# Altium schematic sheet Clock.SchDoc
size A3
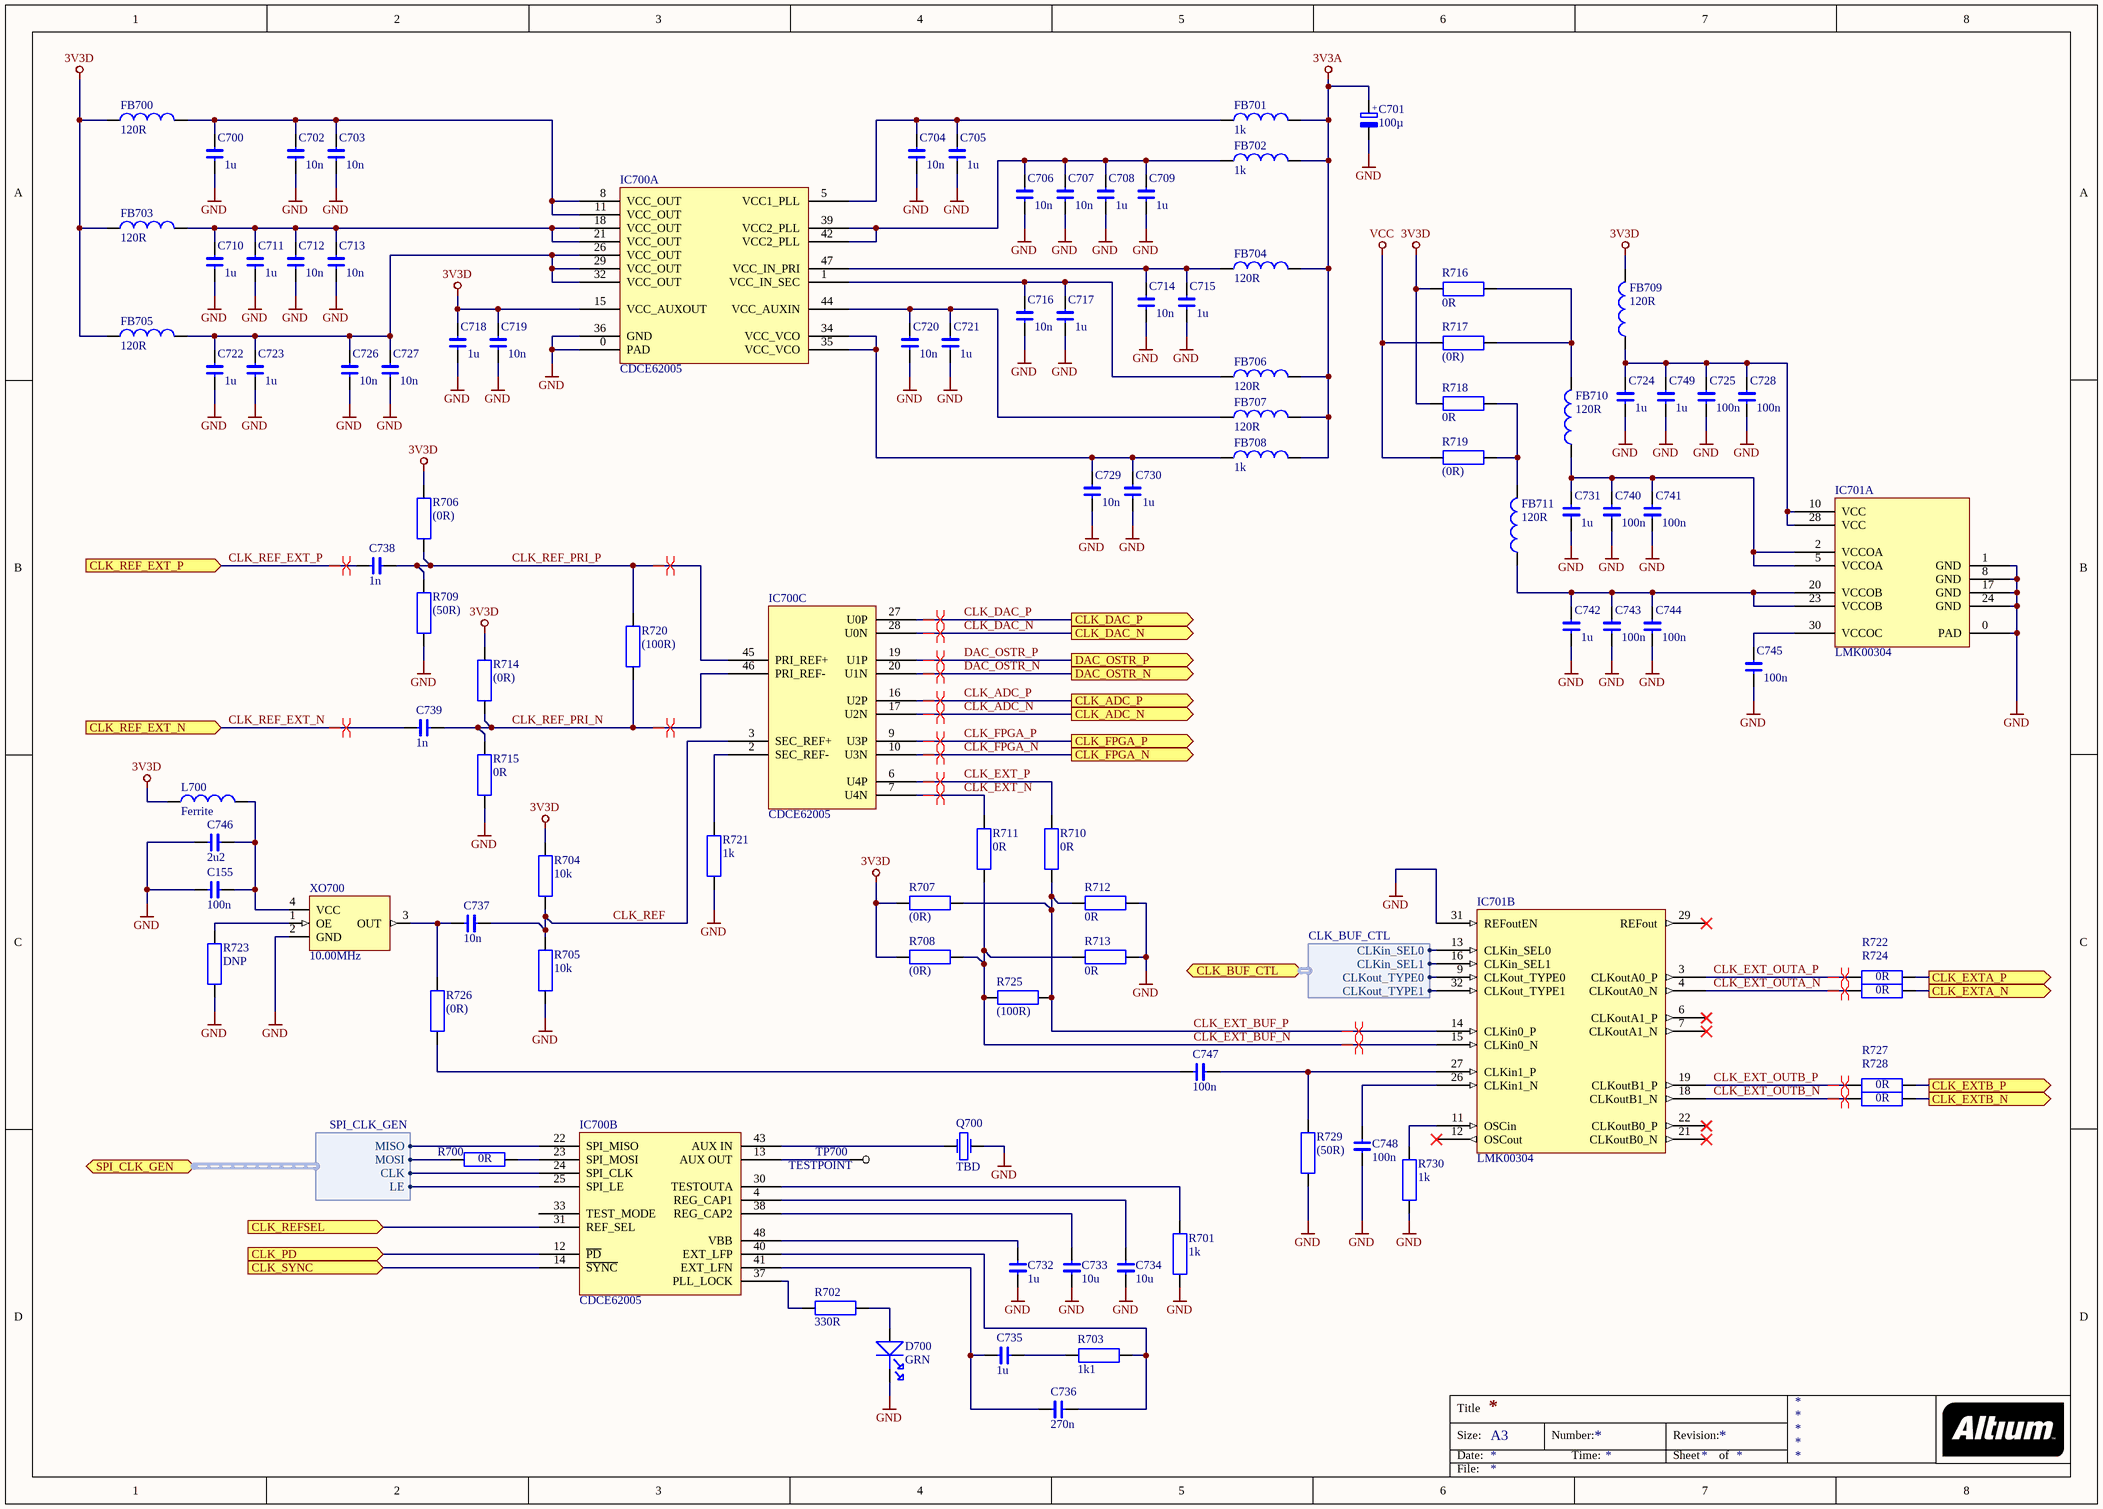
[diagram p0: Clock.SchDoc]

## Parts
C155  100n  [0603 SMALL OUTLINE]
C700  1u  [0603 SMALL OUTLINE]
C701  100µ  [SMD_ELKO_6.3]
C702  10n  [0402]
C703  10n  [0402]
C704  10n  [0402]
C705  1u  [0603 SMALL OUTLINE]
C706  10n  [0402]
C707  10n  [0402]
C708  1u  [0603 SMALL OUTLINE]
C709  1u  [0603 SMALL OUTLINE]
C710  1u  [0603 SMALL OUTLINE]
C711  1u  [0603 SMALL OUTLINE]
C712  10n  [0402]
C713  10n  [0402]
C714  10n  [0402]
C715  1u  [0603 SMALL OUTLINE]
C716  10n  [0402]
C717  1u  [0603 SMALL OUTLINE]
C718  1u  [0603 SMALL OUTLINE]
C719  10n  [0402]
C720  10n  [0402]
C721  1u  [0603 SMALL OUTLINE]
C722  1u  [0603 SMALL OUTLINE]
C723  1u  [0603 SMALL OUTLINE]
C724  1u  [0603 SMALL OUTLINE]
C725  100n  [0402]
C726  10n  [0402]
C727  10n  [0402]
C728  100n  [0402]
C729  10n  [0402]
C730  1u  [0603 SMALL OUTLINE]
C731  1u  [0603 SMALL OUTLINE]
C732  1u  [0603 SMALL OUTLINE]
C733  10u  [0805 SMALL OUTLINE]
C734  10u  [0805 SMALL OUTLINE]
C735  1u  [0603 SMALL OUTLINE]
C736  270n  [0603 SMALL OUTLINE]
C737  10n  [0603 SMALL OUTLINE]
C738  1n  [0603 SMALL OUTLINE]
C739  1n  [0603 SMALL OUTLINE]
C740  100n  [0402]
C741  100n  [0402]
C742  1u  [0603 SMALL OUTLINE]
C743  100n  [0402]
C744  100n  [0402]
C745  100n  [0402]
C746  2u2  [0603 SMALL OUTLINE]
C747  100n  [0603 SMALL OUTLINE]
C748  100n  [0402]
C749  1u  [0603 SMALL OUTLINE]
D700  GRN  [LED SMD 0603]
FB700  120R  [0805 SMALL OUTLINE]
FB701  1k  [0805 SMALL OUTLINE]
FB702  1k  [0805 SMALL OUTLINE]
FB703  120R  [0805 SMALL OUTLINE]
FB704  120R  [0805 SMALL OUTLINE]
FB705  120R  [0805 SMALL OUTLINE]
FB706  120R  [0805 SMALL OUTLINE]
FB707  120R  [0805 SMALL OUTLINE]
FB708  1k  [0805 SMALL OUTLINE]
FB709  120R  [0805 SMALL OUTLINE]
FB710  120R  [0805 SMALL OUTLINE]
FB711  120R  [0805 SMALL OUTLINE]
IC700  CDCE62005  [48VQFN]  (parts A,B,C of 3)
IC701  LMK00304  [WQFN32_LONG]  (parts A,B of 2)
L700  Ferrite  [0805]
Q700  TBD  [XTAL_SMD_60_35]
R700  0R  [0603 SMALL OUTLINE]
R701  1k  [0603 SMALL OUTLINE]
R702  330R  [0603 SMALL OUTLINE]
R703  1k1  [0603 SMALL OUTLINE]
R704  10k  [0603 SMALL OUTLINE]
R705  10k  [0603 SMALL OUTLINE]
R706  (0R)  [0402]
R707  (0R)  [0402]
R708  (0R)  [0402]
R709  (50R)  [0402]
R710  0R  [0402]
R711  0R  [0402]
R712  0R  [0402]
R713  0R  [0402]
R714  (0R)  [0402]
R715  0R  [0402]
R716  0R  [0603 SMALL OUTLINE]
R717  (0R)  [0603 SMALL OUTLINE]
R718  0R  [0603 SMALL OUTLINE]
R719  (0R)  [0603 SMALL OUTLINE]
R720  (100R)  [0402]
R721  1k  [0603 SMALL OUTLINE]
R722  0R  [0402]
R723  DNP  [0603 SMALL OUTLINE]
R724  0R  [0402]
R725  (100R)  [0402]
R726  (0R)  [0603 SMALL OUTLINE]
R727  0R  [0402]
R728  0R  [0402]
R729  (50R)  [0402]
R730  1k  [0603 SMALL OUTLINE]
TP700  TESTPOINT  [TEST_PAD_50]
XO700  10.00MHz  [AST3TQ]

## Ports
CLK_ADC_N (out), CLK_ADC_P (out), CLK_BUF_CTL (harness CLK_BUF_CTL), CLK_DAC_N (out), CLK_DAC_P (out), CLK_EXTA_N (out), CLK_EXTA_P (out), CLK_EXTB_N (out), CLK_EXTB_P (out), CLK_FPGA_N (out), CLK_FPGA_P (out), CLK_PD (in), CLK_REF_EXT_N (in), CLK_REF_EXT_P (in), CLK_REFSEL (in), CLK_SYNC (in), DAC_OSTR_N (out), DAC_OSTR_P (out), SPI_CLK_GEN (harness SPI_CLK_GEN)

## Harnesses
SPI_CLK_GEN: MOSI, MISO, CLK, LE
CLK_BUF_CTL: CLKin_SEL0, CLKin_SEL1, CLKout_TYPE0, CLKout_TYPE1

## Nets
3V3A: C701.1(+) FB701.2 FB702.2 FB704.2 FB706.2 FB707.2 FB708.2
3V3D: C718.1 C719.1 FB700.1 FB703.1 FB705.1 FB709.2 IC700.15(VCC_AUXOUT) L700.1 R704.2 R706.2 R707.2 R708.2 R714.2 R716.2 R718.2
GND: C155.2 C700.2 C701.2(-) C702.2 C703.2 C704.2 C705.2 C706.2 C707.2 C708.2 C709.2 C710.2 C711.2 C712.2 C713.2 C714.2 C715.2 C716.2 C717.2 C718.2 C719.2 C720.2 C721.2 C722.2 C723.2 C724.2 C725.2 C726.2 C727.2 C728.2 C729.2 C730.2 C731.2 C732.2 C733.2 C734.2 C740.2 C741.2 C742.2 C743.2 C744.2 C745.2 C746.2 C748.2 C749.2 D700.K IC700.0(PAD) IC700.36(GND) IC701.0(PAD) IC701.1(GND) IC701.8(GND) IC701.17(GND) IC701.24(GND) IC701.31(REFoutEN) Q700.2 R701.2 R705.1 R709.1 R712.1 R713.1 R715.1 R721.1 R723.1 R729.1 R730.1 XO700.2(GND)
VCC: R717.2 R719.2
CLK_ADC_N: IC700.17(U2N) ; port CLK_ADC_N
CLK_ADC_P: IC700.16(U2P) ; port CLK_ADC_P
CLK_DAC_N: IC700.28(U0N) ; port CLK_DAC_N
CLK_DAC_P: IC700.27(U0P) ; port CLK_DAC_P
CLK_EXT_BUF_N: IC701.15(CLKin0_N) R708.1 R711.1 R713.2 R725.1
CLK_EXT_BUF_P: IC701.14(CLKin0_P) R707.1 R710.1 R712.2 R725.2
CLK_EXT_N: IC700.7(U4N) R711.2
CLK_EXT_OUTA_N: IC701.4(CLKoutA0_N) R724.1
CLK_EXT_OUTA_P: IC701.3(CLKoutA0_P) R722.1
CLK_EXT_OUTB_N: IC701.18(CLKoutB1_N) R728.1
CLK_EXT_OUTB_P: IC701.19(CLKoutB1_P) R727.1
CLK_EXT_P: IC700.6(U4P) R710.2
CLK_EXTA_N: R724.2 ; port CLK_EXTA_N
CLK_EXTA_P: R722.2 ; port CLK_EXTA_P
CLK_EXTB_N: R728.2 ; port CLK_EXTB_N
CLK_EXTB_P: R727.2 ; port CLK_EXTB_P
CLK_FPGA_N: IC700.10(U3N) ; port CLK_FPGA_N
CLK_FPGA_P: IC700.9(U3P) ; port CLK_FPGA_P
CLK_PD: IC700.12(~{PD}) ; port CLK_PD
CLK_REF: C737.2 IC700.3(SEC_REF+) R704.1 R705.2
CLK_REF_EXT_N: C739.1 ; port CLK_REF_EXT_N
CLK_REF_EXT_P: C738.1 ; port CLK_REF_EXT_P
CLK_REF_PRI_N: C739.2 IC700.46(PRI_REF-) R714.1 R715.2 R720.1
CLK_REF_PRI_P: C738.2 IC700.45(PRI_REF+) R706.1 R709.2 R720.2
CLK_REFSEL: IC700.31(REF_SEL) ; port CLK_REFSEL
CLK_SYNC: IC700.14(~{SYNC}) ; port CLK_SYNC
DAC_OSTR_N: IC700.20(U1N) ; port DAC_OSTR_N
DAC_OSTR_P: IC700.19(U1P) ; port DAC_OSTR_P
NetC155_1: C155.1 C746.1 L700.2 XO700.4(VCC)
NetC700_1: C700.1 C702.1 C703.1 FB700.2 IC700.8(VCC_OUT) IC700.11(VCC_OUT)
NetC704_1: C704.1 C705.1 FB701.1 IC700.5(VCC1_PLL)
NetC706_1: C706.1 C707.1 C708.1 C709.1 FB702.1 IC700.39(VCC2_PLL) IC700.42(VCC2_PLL)
NetC710_1: C710.1 C711.1 C712.1 C713.1 FB703.2 IC700.18(VCC_OUT) IC700.21(VCC_OUT)
NetC714_1: C714.1 C715.1 FB704.1 IC700.47(VCC_IN_PRI)
NetC716_1: C716.1 C717.1 FB706.1 IC700.1(VCC_IN_SEC)
NetC720_1: C720.1 C721.1 FB707.1 IC700.44(VCC_AUXIN)
NetC722_1: C722.1 C723.1 C726.1 C727.1 FB705.2 IC700.26(VCC_OUT) IC700.29(VCC_OUT) IC700.32(VCC_OUT)
NetC724_1: C724.1 C725.1 C728.1 C749.1 FB709.1 IC701.10(VCC) IC701.28(VCC)
NetC729_1: C729.1 C730.1 FB708.1 IC700.34(VCC_VCO) IC700.35(VCC_VCO)
NetC731_1: C731.1 C740.1 C741.1 FB710.1 IC701.2(VCCOA) IC701.5(VCCOA)
NetC732_1: C732.1 IC700.48(VBB)
NetC733_1: C733.1 IC700.38(REG_CAP2)
NetC734_1: C734.1 IC700.4(REG_CAP1)
NetC735_1: C735.1 C736.2 IC700.41(EXT_LFN)
NetC735_2: C735.2 R703.2
NetC736_1: C736.1 IC700.40(EXT_LFP) R703.1
NetC737_1: C737.1 R726.1 XO700.3(OUT)
NetC742_1: C742.1 C743.1 C744.1 FB711.1 IC701.20(VCCOB) IC701.23(VCCOB)
NetC745_1: C745.1 IC701.30(VCCOC)
NetC747_1: C747.1 R726.2
NetC747_2: C747.2 IC701.27(CLKin1_P) R729.2
NetC748_1: C748.1 IC701.26(CLKin1_N)
NetD700_A: D700.A R702.1
NetFB710_2: FB710.2 R716.1 R717.1
NetFB711_2: FB711.2 R718.1 R719.1
NetIC700_2: IC700.2(SEC_REF-) R721.2
NetIC700_13: IC700.13(AUX_OUT) TP700.1
NetIC700_22: IC700.22(SPI_MISO) ; port SPI_CLK_GEN.MISO
NetIC700_23: IC700.23(SPI_MOSI) R700.2
NetIC700_24: IC700.24(SPI_CLK) ; port SPI_CLK_GEN.CLK
NetIC700_25: IC700.25(SPI_LE) ; port SPI_CLK_GEN.LE
NetIC700_30: IC700.30(TESTOUTA) R701.1
NetIC700_37: IC700.37(PLL_LOCK) R702.2
NetIC700_43: IC700.43(AUX_IN) Q700.1
NetIC701_9: IC701.9(CLKout_TYPE0) ; port CLK_BUF_CTL.CLKout_TYPE0
NetIC701_11: IC701.11(OSCin) R730.2
NetIC701_13: IC701.13(CLKin_SEL0) ; port CLK_BUF_CTL.CLKin_SEL0
NetIC701_16: IC701.16(CLKin_SEL1) ; port CLK_BUF_CTL.CLKin_SEL1
NetIC701_32: IC701.32(CLKout_TYPE1) ; port CLK_BUF_CTL.CLKout_TYPE1
NetR700_1: R700.1 ; port SPI_CLK_GEN.MOSI
NetR723_2: R723.2 XO700.1(OE)

Not connected (* = marked no-connect by the designer): IC700 33(TEST_MODE); IC701 6(CLKoutA1_P)* 7(CLKoutA1_N)* 12(OSCout)* 21(CLKoutB0_N)* 22(CLKoutB0_P)* 29(REFout)*

## Layout directives
differential pair: CLK_ADC_N, CLK_ADC_P, CLK_DAC_N, CLK_DAC_P, CLK_EXT_BUF_N, CLK_EXT_BUF_P, CLK_EXT_N, CLK_EXT_OUTA_N, CLK_EXT_OUTA_P, CLK_EXT_OUTB_N, CLK_EXT_OUTB_P, CLK_EXT_P, CLK_FPGA_N, CLK_FPGA_P, CLK_REF_EXT_N, CLK_REF_EXT_P, CLK_REF_PRI_N, CLK_REF_PRI_P, DAC_OSTR_N, DAC_OSTR_P

## Notes on the sheet
- Title
- Size:
- Date:
- A3
- Number:
- Time:
- Revision:
- Sheet
- of
- File:

## Library data of the parts
C155 C700 C702-C749 = C
C701 = ELCO: EEH-ZA1E101XP
D700 = LED SMD: WURTH 150060VS75000
FB700-FB711 L700 = L
IC700 = CDCE62005: Five/Ten Output Clock Generator/Jitter Cleaner With Integrated Dual VCOs
IC701 = LMK00304: 3-GHz 4-Output Differential Clock Buffer/Level Translator
Q700 = CRYSTAL: XX MHz
R700-R730 = R
TP700 = TESTPOINT: pin to pad: 1>0
XO700 = OSZILLATOR_4P SMD: AST3TQ-10.00MHz-1